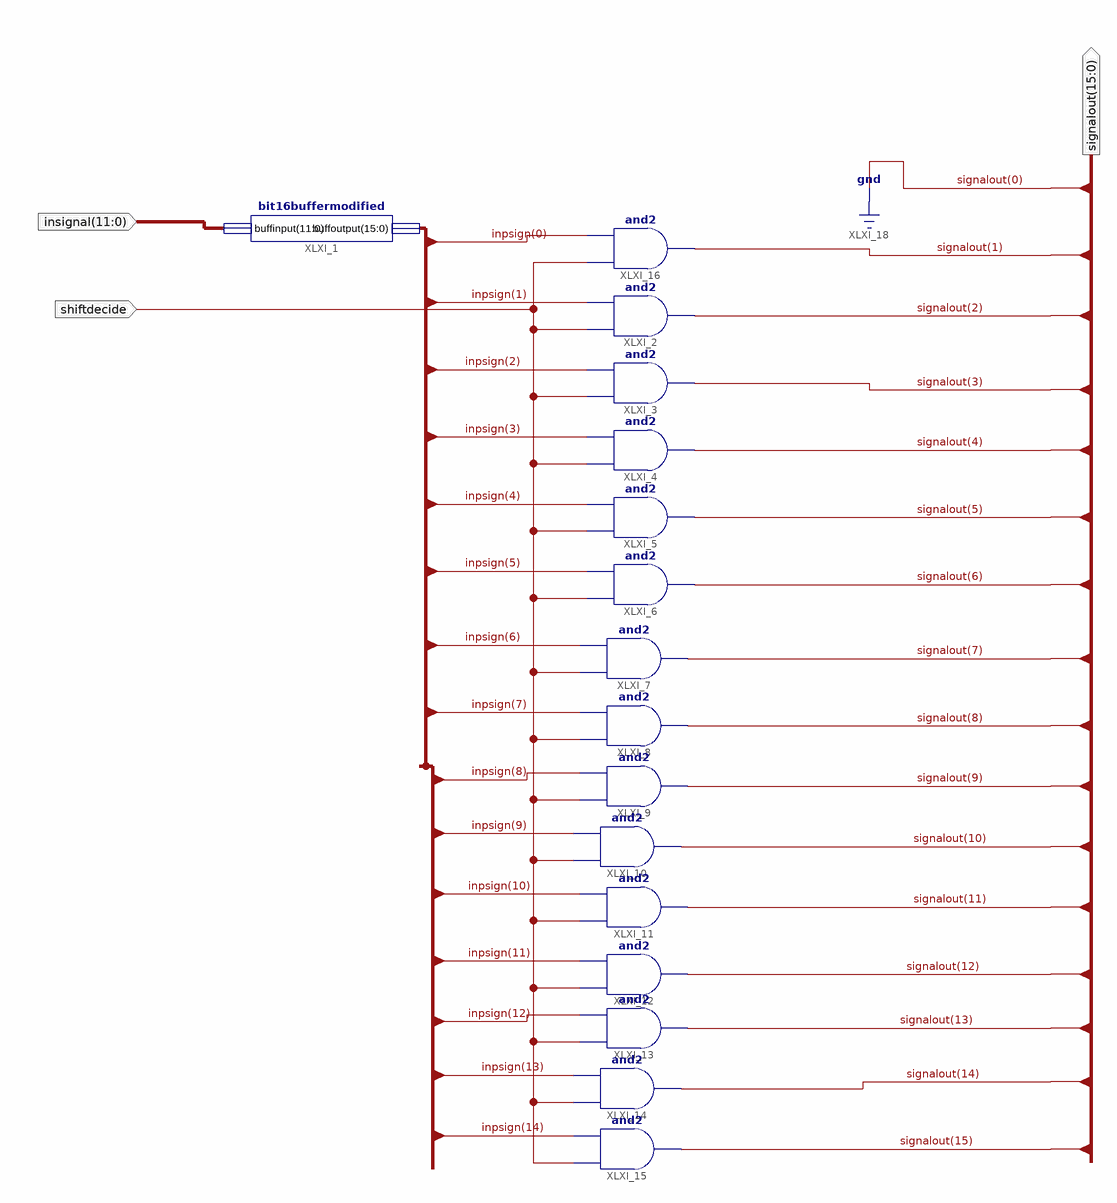
[diagram p0: schematic sheet 1]
// Xilinx ISE schematic shiftr2.sch (spartan3) as structural Verilog: 16 symbols, 3 ports
module shiftr2 (
  input  [11:0] insignal,
  input  shiftdecide,
  output [15:0] signalout
);

  wire [15:0] inpsign;

  bit16buffermodified XLXI_1 (.buffinput(insignal), .buffoutput(inpsign));
  and XLXI_2 (signalout[2], shiftdecide, inpsign[1]);
  and XLXI_3 (signalout[3], shiftdecide, inpsign[2]);
  and XLXI_4 (signalout[4], shiftdecide, inpsign[3]);
  and XLXI_5 (signalout[5], shiftdecide, inpsign[4]);
  and XLXI_6 (signalout[6], shiftdecide, inpsign[5]);
  and XLXI_7 (signalout[7], shiftdecide, inpsign[6]);
  and XLXI_8 (signalout[8], shiftdecide, inpsign[7]);
  and XLXI_9 (signalout[9], shiftdecide, inpsign[8]);
  and XLXI_10 (signalout[10], shiftdecide, inpsign[9]);
  and XLXI_11 (signalout[11], shiftdecide, inpsign[10]);
  and XLXI_12 (signalout[12], shiftdecide, inpsign[11]);
  and XLXI_13 (signalout[13], shiftdecide, inpsign[12]);
  and XLXI_14 (signalout[14], shiftdecide, inpsign[13]);
  and XLXI_15 (signalout[15], shiftdecide, inpsign[14]);
  and XLXI_16 (signalout[1], shiftdecide, inpsign[0]);

  assign signalout[0] = 1'b0;
endmodule
